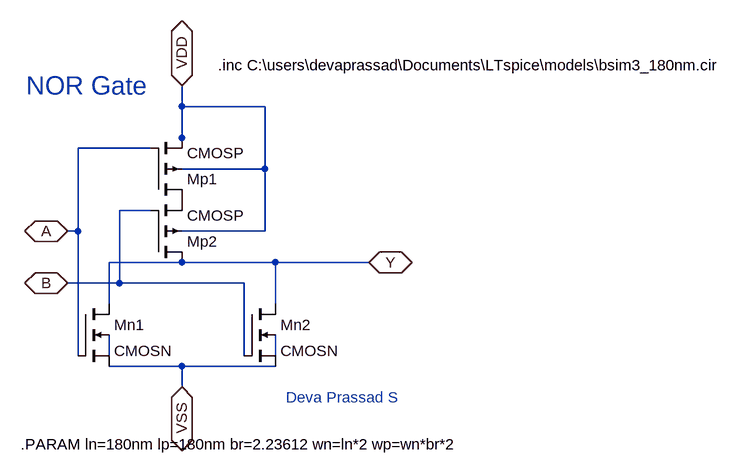
[diagram p0: schematic nor1x.asc]
nor1x.asc, the LTspice schematic file:
Version 4.1
SHEET 1 1188 680
WIRE 224 -64 224 -96
WIRE 352 -64 224 -64
WIRE 224 -16 224 -64
WIRE 176 0 64 0
WIRE 224 0 224 -16
WIRE 352 32 352 -64
WIRE 352 32 224 32
WIRE 176 96 128 96
WIRE 64 128 64 0
WIRE 64 128 48 128
WIRE 352 128 352 32
WIRE 352 128 224 128
WIRE 224 176 112 176
WIRE 368 176 224 176
WIRE 512 176 368 176
WIRE 128 208 128 96
WIRE 128 208 48 208
WIRE 320 208 128 208
WIRE 112 240 112 176
WIRE 368 240 368 176
WIRE 64 320 64 128
WIRE 112 320 112 288
WIRE 320 320 320 208
WIRE 368 320 368 288
WIRE 224 336 112 336
WIRE 368 336 224 336
WIRE 224 368 224 336
FLAG 512 176 Y
IOPIN 512 176 BiDir
FLAG 48 128 A
IOPIN 48 128 BiDir
FLAG 48 208 B
IOPIN 48 208 BiDir
FLAG 224 -96 VDD
IOPIN 224 -96 BiDir
FLAG 224 368 VSS
IOPIN 224 368 BiDir
SYMBOL nmos4 64 240 R0
SYMATTR InstName Mn1
SYMATTR Value2 l={ln} w={wn} ad={ln*wn} as={ln*wn} pd={2*ln+wn} ps={2*ln+wn}
SYMATTR Value CMOSN
SYMBOL nmos4 320 240 R0
SYMATTR InstName Mn2
SYMATTR Value2 l={ln} w={wn} ad={ln*wn} as={ln*wn} pd={2*ln+wn} ps={2*ln+wn}
SYMATTR Value CMOSN
SYMBOL pmos4 176 80 M180
SYMATTR InstName Mp1
SYMATTR Value2 l={lp} w={wp} ad={lp*wp} as={lp*wp} pd={2*lp+wp} ps={2*lp+wp}
SYMATTR Value CMOSP
SYMBOL pmos4 176 176 M180
SYMATTR InstName Mp2
SYMATTR Value2 l={lp} w={wp} ad={lp*wp} as={lp*wp} pd={2*lp+wp} ps={2*lp+wp}
SYMATTR Value CMOSP
TEXT 384 384 Left 2 ;Deva Prassad S
TEXT -16 -96 Left 4 ;NOR Gate
TEXT 280 -128 Left 2 !.inc C:\\users\\devaprassad\\Documents\\LTspice\\models\\bsim3_180nm.cir
TEXT -24 456 Left 2 !.PARAM ln=180nm lp=180nm br=2.23612 wn=ln*2 wp=wn*br*2

The netlist it stands for:
* nor1x.asc
Mn1 Y A VSS N001 CMOSN l={ln} w={wn} ad={ln*wn} as={ln*wn} pd={2*ln+wn} ps={2*ln+wn}
Mn2 Y B VSS N002 CMOSN l={ln} w={wn} ad={ln*wn} as={ln*wn} pd={2*ln+wn} ps={2*ln+wn}
Mp1 P001 A VDD VDD CMOSP l={lp} w={wp} ad={lp*wp} as={lp*wp} pd={2*lp+wp} ps={2*lp+wp}
Mp2 Y B P001 VDD CMOSP l={lp} w={wp} ad={lp*wp} as={lp*wp} pd={2*lp+wp} ps={2*lp+wp}
.model NMOS NMOS
.model PMOS PMOS
.lib standard.mos
* Deva Prassad S
* NOR Gate
.inc C:\users\devaprassad\Documents\LTspice\models\bsim3_180nm.cir
.PARAM ln=180nm lp=180nm br=2.23612 wn=ln*2 wp=wn*br*2
.backanno
.end